# Altium schematic sheet Power.SchDoc
size A4; SheetNumber: 4; SheetTotal: 3
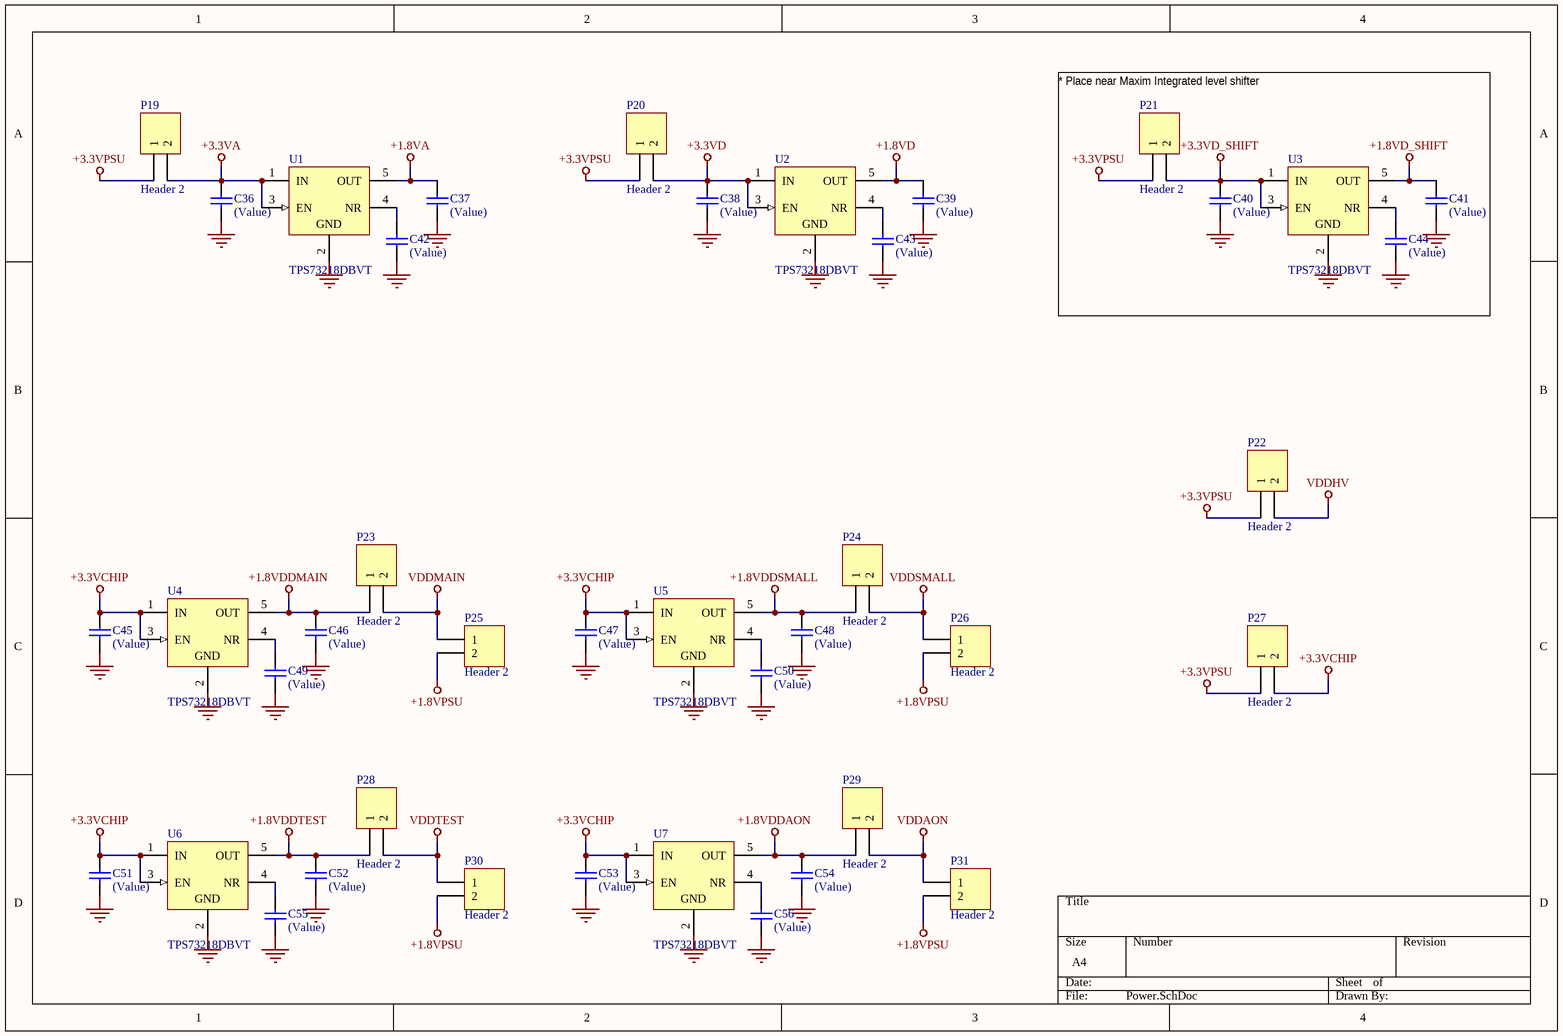
[diagram p0: Power.SchDoc]

## Parts
C36  (Value)  [CAPC1608X90X35ML10T15]
C37  (Value)  [CAPC1608X90X35ML10T15]
C38  (Value)  [CAPC1608X90X35ML10T15]
C39  (Value)  [CAPC1608X90X35ML10T15]
C40  (Value)  [CAPC1608X90X35ML10T15]
C41  (Value)  [CAPC1608X90X35ML10T15]
C42  (Value)  [CAPC1608X90X35ML10T15]
C43  (Value)  [CAPC1608X90X35ML10T15]
C44  (Value)  [CAPC1608X90X35ML10T15]
C45  (Value)  [CAPC1608X90X35ML10T15]
C46  (Value)  [CAPC1608X90X35ML10T15]
C47  (Value)  [CAPC1608X90X35ML10T15]
C48  (Value)  [CAPC1608X90X35ML10T15]
C49  (Value)  [CAPC1608X90X35ML10T15]
C50  (Value)  [CAPC1608X90X35ML10T15]
C51  (Value)  [CAPC1608X90X35ML10T15]
C52  (Value)  [CAPC1608X90X35ML10T15]
C53  (Value)  [CAPC1608X90X35ML10T15]
C54  (Value)  [CAPC1608X90X35ML10T15]
C55  (Value)  [CAPC1608X90X35ML10T15]
C56  (Value)  [CAPC1608X90X35ML10T15]
P19  Header 2  [HDR1X2]
P20  Header 2  [HDR1X2]
P21  Header 2  [HDR1X2]
P22  Header 2  [HDR1X2]
P23  Header 2  [HDR1X2]
P24  Header 2  [HDR1X2]
P25  Header 2  [HDR1X2]
P26  Header 2  [HDR1X2]
P27  Header 2  [HDR1X2]
P28  Header 2  [HDR1X2]
P29  Header 2  [HDR1X2]
P30  Header 2  [HDR1X2]
P31  Header 2  [HDR1X2]
U1  TPS73218DBVT  [DBV0005A_N]
U2  TPS73218DBVT  [DBV0005A_N]
U3  TPS73218DBVT  [DBV0005A_N]
U4  TPS73218DBVT  [DBV0005A_N]
U5  TPS73218DBVT  [DBV0005A_N]
U6  TPS73218DBVT  [DBV0005A_N]
U7  TPS73218DBVT  [DBV0005A_N]

## Nets
+1.8VA: C37.1 U1.5(OUT)
+1.8VD: C39.1 U2.5(OUT)
+1.8VD_SHIFT: C41.1 U3.5(OUT)
+1.8VDDAON: C54.1 P29.1 U7.5(OUT)
+1.8VDDMAIN: C46.1 P23.1 U4.5(OUT)
+1.8VDDSMALL: C48.1 P24.1 U5.5(OUT)
+1.8VDDTEST: C52.1 P28.1 U6.5(OUT)
+1.8VPSU: P25.2 P26.2 P30.2 P31.2
+3.3VA: C36.1 P19.2 U1.1(IN) U1.3(EN)
+3.3VCHIP: C45.1 C47.1 C51.1 C53.1 P27.2 U4.1(IN) U4.3(EN) U5.1(IN) U5.3(EN) U6.1(IN) U6.3(EN) U7.1(IN) U7.3(EN)
+3.3VD: C38.1 P20.2 U2.1(IN) U2.3(EN)
+3.3VD_SHIFT: C40.1 P21.2 U3.1(IN) U3.3(EN)
+3.3VPSU: P19.1 P20.1 P21.1 P22.1 P27.1
GND: C36.2 C37.2 C38.2 C39.2 C40.2 C41.2 C42.2 C43.2 C44.2 C45.2 C46.2 C47.2 C48.2 C49.2 C50.2 C51.2 C52.2 C53.2 C54.2 C55.2 C56.2 U1.2(GND) U2.2(GND) U3.2(GND) U4.2(GND) U5.2(GND) U6.2(GND) U7.2(GND)
VDDAON: P29.2 P31.1
VDDHV: P22.2
VDDMAIN: P23.2 P25.1
VDDSMALL: P24.2 P26.1
VDDTEST: P28.2 P30.1
NetC42_1: C42.1 U1.4(NR)
NetC43_1: C43.1 U2.4(NR)
NetC44_1: C44.1 U3.4(NR)
NetC49_1: C49.1 U4.4(NR)
NetC50_1: C50.1 U5.4(NR)
NetC55_1: C55.1 U6.4(NR)
NetC56_1: C56.1 U7.4(NR)

## Notes on the sheet
- * Place near Maxim Integrated level shifter

## Library data of the parts
C36-C56 = CMP-2000-04945-1: 0603; Manufacturer: Murata; Capacitance: 22pF; Tolerance (%): ±5%; Rated Voltage: 50V; Dielectric: C0G; Manufacturer URL: http://www.murata.com/; Datasheet Version: Jul-06; Package Reference: 603; Case Size/Dimension: 0603; Package Description: 2-Pin Surface Mount Device, Body 1.6 x 0.8 mm; Datasheet URL: https://datasheet.ciiva.com/11786/0900766b807a1cab-11786398.pdf
P19-P31 = Header 2: Header, 2-Pin; LatestRevisionDate: 17-Jul-2002; LatestRevisionNote: Re-released for DXP Platform.; Publisher: Altium Limited
U1-U7 = CMP-0394-00378-2: Single Output Fast Transient Response LDO, 200 mA, Fixed 1.8 V Output, 1.7 to 5.5 V Input, with Reverse Current Protection, 5-pin SOT-23 (DBV), -40 to 85 degC, Green (RoHS & no Sb/Br); Manufacturer: Texas Instruments; Iout(Max)(A): 0.25; Iq(Typ)(mA): 0.4; Accuracy(%): 1; Vout Adj(Min)(V): 1.8; Vdo(Typ)(mV): 40; SubFamily: Single Channel LDO; Vin(Min)(V): 1.7; Vin(Max)(V): 5.5; ComponentLink1URL: http://www.ti.com/; PartNumber: TPS73218DBVT; Eco-Plan: Green (RoHS & no Sb/Br); ComponentLink2Description: Datasheet; PackageVersion: 4073253-4/K; ComponentLink3URL: http://www.ti.com/litv/pdf/mpds018i; ComponentLink3Description: Package Specification; ComponentLink1Description: Manufacturer URL; Vout Adj(Max)(V): 1.8; Code_JEDEC: MO-178; ComponentLink2URL: http://www.ti.com/general/docs/lit/getliterature.tsp?genericPartNumber=TPS73218&fileType=pdf; DatasheetVersion: SBVS037O; Mounting Technology: Surface Mount; PackageReference: DBV0005A; PackageDescription: 5-Pin Plastic Small Outline, Body 1.60 Ãƒâ€” 2.90 mm, Pitch 0.95 mm; Fixed Output Options(V): 1.8